# Altium schematic sheet Tag_Lastmodulation_Sekundär.SchDoc
size A4; SheetNumber: 6; SheetTotal: 6
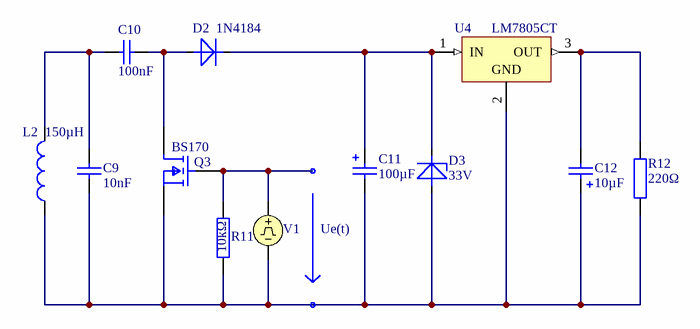
[diagram p0: Tag_Lastmodulation_Sekundär.SchDoc]

## Parts
*  Ue(t)
C9  value 10nF  [rad-7.2/2.5/5]  (hidden comment: KO)
C10  value 100nF  [rad-7.2/2.5/5]  (hidden comment: KO)
C11  value 100µF  [RB-.1/.2]  (hidden comment: ELKO)
C12  value 10µF  [RB-.1/.2]  (hidden comment: ELKO)
D2  1N4184  [DIODE-0.6]
D3  33V  [DIODE-0.4]
L2  value 150µH  (hidden comment: Inductor)
Q3  BS170  [FP-SOT23-IPC_A]
R11  value 10kΩ  [Axial-0.4]  (hidden comment: RES)
R12  value 220Ω  [Axial-0.4]  (hidden comment: RES)
U4  LM7805CT  [FAIR-TO-220-3]
V1  PULSE(0 5 0 4u 1u 0 5u)  (value not drawn)

## Nets
NetC9_1: C9.1 C11.2 C12.1 D3.1(A) L2.2 Q3.2(S) R11.1 R12.1 U4.2(GND) V1.2
NetC9_2: C9.2 C10.2 L2.1
NetC10_1: C10.1 D2.1(A) Q3.3(D)
NetC11_1: C11.1 D2.2(K) D3.2(K) U4.1(IN)
NetC12_2: C12.2 R12.2 U4.3(OUT)
NetQ3_G1: Q3.G1(G) R11.2 V1.1

## Library data of the parts
* = Spannungspfeil
C9 C10 = KO: Kondensator
D2 = DIODE
D3 = Z-DIODE
L2 = Inductor: SimulationGenericComponent: True
Q3 = CMP-12801-000064-2: MOSFET N-CH 60V .15MA SOT23-3; On-State Resistance: 5R; Continuous Drain Current (ID): 150mA; Threshold Voltage: 3V; Number of Channels: 1; Gate to Source Voltage (Vgs): 20V; Turn-On Delay Time: 10ns; Power Dissipation: 330mW; Element Configuration: Single; Input Capacitance: 60pF; Weight: 0.000282oz; Height: 1mm; Max Operating Temperature: 150°C; Dual Supply Voltage: 60V; Termination: SMD/SMT; Number of Pins: 3; Number of Elements: 1; Mount: Surface Mount; Min Operating Temperature: -55°C; Nominal Vgs: 3V; Width: 1.4mm; Drain to Source Breakdown Voltage: 60V; Turn-Off Delay Time: 10ns; Case/Package: SOT-23; REACH SVHC: No SVHC; Packaging: Tape and Reel; Length: 3.05mm; Max Power Dissipation: 330mW; Rds On Max: 5R; Lead Free: Lead Free; Contact Plating: Tin; Drain to Source Resistance: 5R; Drain to Source Voltage (Vdss): 60V; Package Quantity: 3000; Current Rating: 150mA; Voltage Rating (DC): 60V
R11 R12 = RES: Widerstand
U4 = CMP-2000-04938-1: Positive Voltage Regulator, 5 V, 1 A, -40 to 125 degC, 3-Pin TO-220, RoHS, Tube; Manufacturer: FairchildSemiconductor; Maximum Input Voltage: 35V; Maximum Quiescent Current: 8mA; Load Regulation: 100mV; Maximum Output Current: 2.2(Typ)A; Output Type: Fixed; Typical Dropout Voltage @ Current: 2@1AV; Rad Hard: No; Output Voltage: 5V; Accuracy: ±4%; Number of Outputs: 1; Category: LinearRegulator; Package Description: 3-Pin Through Hole Device, Body 10 x 4.5 mm, Pitch 2.54 mm; Packaging: Rail/Tube; Mounting: ThroughHole; Polarity: Positive; Manufacturer URL: https://www.fairchildsemi.com/; Line Regulation: 100mV; Datasheet Version: Aug-12; Datasheet URL: https://datasheet.ciiva.com/26904/lm7805ct-26904988.pdf; Package Reference: TO-220; Package URL: https://www.fairchildsemi.com/package-drawings/TO/TO220B03.pdf; Package: 3TO-220AB; Operating Temperature: -40to125degC; Type: Linear
V1 = VPULSE: Pulse Voltage Source; Note: PCB Footprint - Not required; Initial Value: 0; Pulsed Value: 5; AC Magnitude: 1; Published: 8-Jun-2000; LatestRevisionDate: 15-Nov-2004; LatestRevisionNote: Corrected Netlist.; PackageReference: Not Applicable; Publisher: Altium Limited; Rise Time: 4u; Fall Time: 1u; Pulse Width: 0; Period: 5u; DC Magnitude: 0; AC Phase: 0